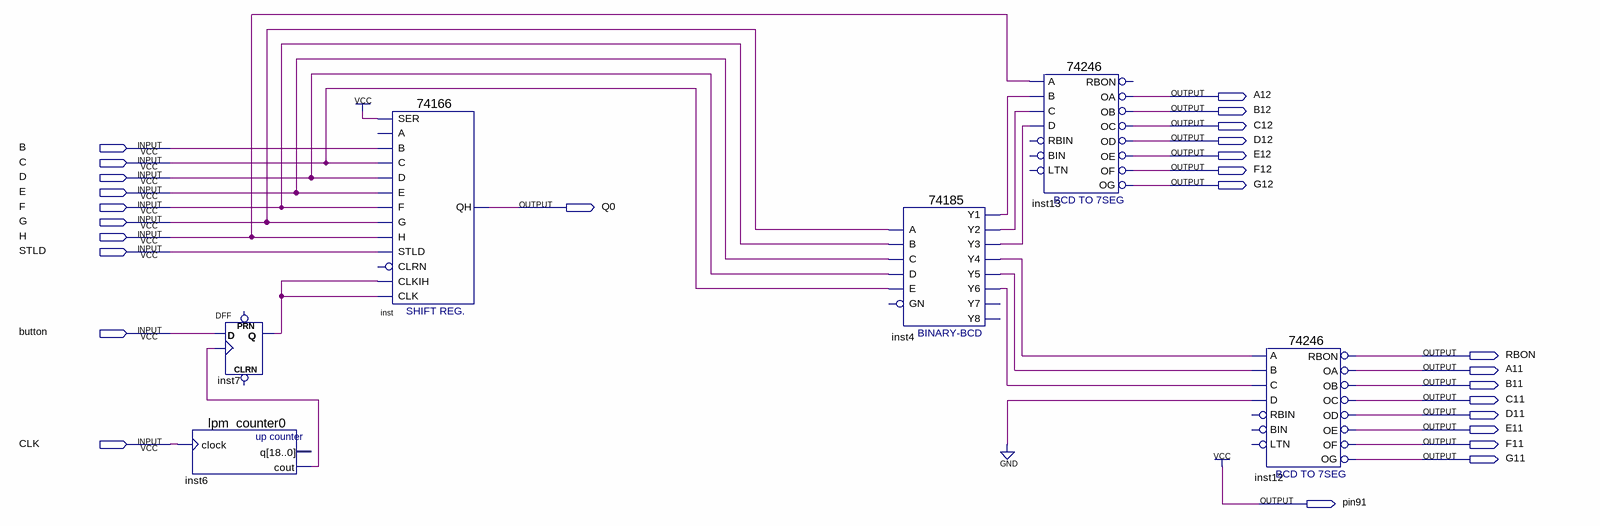
[diagram p0: schematic sheet]
// Quartus schematic Register3.bdf as structural Verilog: 6 symbols, 27 pins
module Register3 (
  input  B,
  input  C,
  input  D,
  input  E,
  input  F,
  input  G,
  input  H,
  input  STLD,
  input  button,
  input  CLK,
  output A12,
  output B12,
  output C12,
  output D12,
  output E12,
  output F12,
  output G12,
  output Q0,
  output RBON,
  output A11,
  output B11,
  output C11,
  output D11,
  output E11,
  output F11,
  output G11,
  output pin91
);

  wire inst4_y1, inst4_y2, inst4_y3, inst4_y4, inst4_y5, inst4_y6, inst6_cout, inst7_q;

  lpm_counter0 inst6 (.clock(CLK), .cout(inst6_cout));  // open: q
  DFF inst7 (.CLK(inst6_cout), .D(button), .Q(inst7_q));  // open: CLRN, PRN
  \74166  inst (
    .SER(1'b1), .C(C), .D(D), .E(E), .B(B), .STLD(STLD), .H(H), .G(G), .F(F), .CLK(inst7_q), .CLKIH(inst7_q),
    .QH(Q0));  // open: A, CLRN
  \74185  inst4 (
    .A(G), .B(F), .D(D), .C(E), .E(C), .Y1(inst4_y1), .Y3(inst4_y3), .Y2(inst4_y2), .Y5(inst4_y5),
    .Y4(inst4_y4), .Y6(inst4_y6));  // open: GN, Y8, Y7
  \74246  inst13 (
    .B(inst4_y1), .A(H), .D(inst4_y3), .C(inst4_y2), .OD(D12), .OC(C12), .OB(B12), .OE(E12), .OF(F12),
    .OA(A12), .OG(G12));  // open: RBIN, LTN, BIN, RBON
  \74246  inst12 (
    .B(inst4_y5), .A(inst4_y4), .D(1'b0), .C(inst4_y6), .OD(D11), .RBON(RBON), .OC(C11), .OB(B11), .OE(E11),
    .OF(F11), .OA(A11), .OG(G11));  // open: RBIN, LTN, BIN

  assign pin91 = 1'b1;
endmodule
